# Altium schematic sheet IR.SchDoc
size A4; Revision: 0
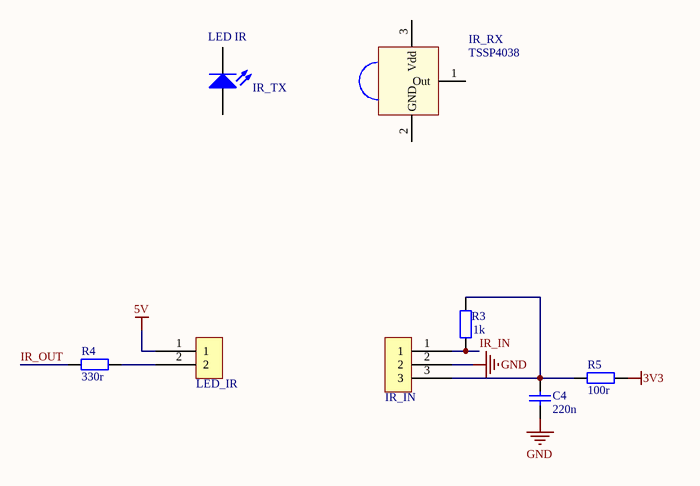
[diagram p0: IR.SchDoc]

## Parts
C4  220n  [0805-C]
IR_IN  Bornier_3_vis  [282834-3]  (value not drawn)
IR_RX  TSSP4038  (mechanical)
IR_TX  LED IR  (mechanical)
LED_IR  Bornier_2_vis  [282834-2]  (value not drawn)
R3  1k  [0805-R]
R4  330r  [0805-R]
R5  100r  [0805-R]

## Nets
3V3: R5.2
5V: LED_IR.1
GND: C4.1 IR_IN.2
IR_IN: IR_IN.1 R3.1
IR_OUT: R4.1
NetC4_2: C4.2 IR_IN.3 R3.2 R5.1
NetLED_IR_2: LED_IR.2 R4.2

Not connected (* = marked no-connect by the designer): IR_RX 1(Out) 2(GND) 3(Vdd); IR_TX 1(K) 2(A)

## Notes on the sheet
- Title
- Size:
- Date:
- A4
- Number:
- Time:
- Revision:
- Sheet
- of
- File:

## Library data of the parts
C4 = Cap_np: Condensateur céramique multicouche CMS, 0.22 µF, 50 V, 0805 [2012 Metric], ± 10%, X7R; Fabricant: WALSIN; Fournisseur: Farnell; RefFabricant: 0805B224K500CT; RefFournisseur: 2496964; Voltage: 50V; Valeur: 220n
IR_IN = Bornier_3_vis: Bornier fil-à-carte, 2.54 mm, 3 Voies, 30 AWG, 16 AWG, 1.4 mm², Par vis; Fabricant: TE; Fournisseur: Farnell; RefFournisseur: 2396254; Valeur: 10A - 3voies; Voltage: 150V; RefFabricant: 282834-3
IR_RX = TSSP93056: Récepteur infrarouge, Barrière lumineuse, 38 kHz, Traversant Vue latérale, 25m, 0.4 mW/m²; Fabricant: Vishay; Fournisseur: Farnell; RefFournisseur: 2251441; RefFabricant: TSSP4038
IR_TX = LED white: Emetteur infrarouge, Haute Puissance, 940 nm, 17 °, T-1 3/4 (5mm), 15 mW/Sr, 15 ns, 15 ns; Fabricant: VISHAY; Fournisseur: Farnell; RefFabricant: TSAL6200; RefFournisseur: 3152856; Valeur: 940nm
LED_IR = Bornier_2_vis: Bornier fil-à-carte, 2.54 mm, 2 Voies, 30 AWG, 16 AWG, 1.4 mm², Par vis; Fabricant: TE; Fournisseur: Farnell; RefFournisseur: 2112482; Valeur: 10A - 2voies; Voltage: 150V; RefFabricant: 282834-2
R3 = Res: Résistance à puce CMS, Couche épaisse, 1 kohm, ± 1%, 125 mW, 0805 [2012 Metric], Couche épaisse; Fabricant: MULTICOMP PRO; Fournisseur: Farnell; RefFabricant: MCWR08X1001FTL; RefFournisseur: 2447587; Revision: July-2002: Re-released for DXP Platform.; Valeur: 1k
R4 = Res: Résistance à puce CMS, Couche épaisse, 330 ohm, ± 1%, 125 mW, 0805 [2012 Metric], Couche épaisse; Fabricant: MULTICOMP PRO; Fournisseur: Farnell; RefFabricant: MCWR08X3300FTL; RefFournisseur: 2447638; Voltage: 150V; Revision: July-2002: Re-released for DXP Platform.; Valeur: 330r
R5 = Res: Résistance à puce CMS, 100 ohm, ± 1%, 500 mW, 0805 [2012 Metric], Couche épaisse, Anti-Surtension; Fabricant: Yageo; Fournisseur: Farnell; RefFabricant: SR0805FR-47100RL; RefFournisseur: 3496794; Voltage: 150V; Revision: July-2002: Re-released for DXP Platform.; Valeur: 100r